# EAGLE design dockerkit (EAGLE 9.6.2)
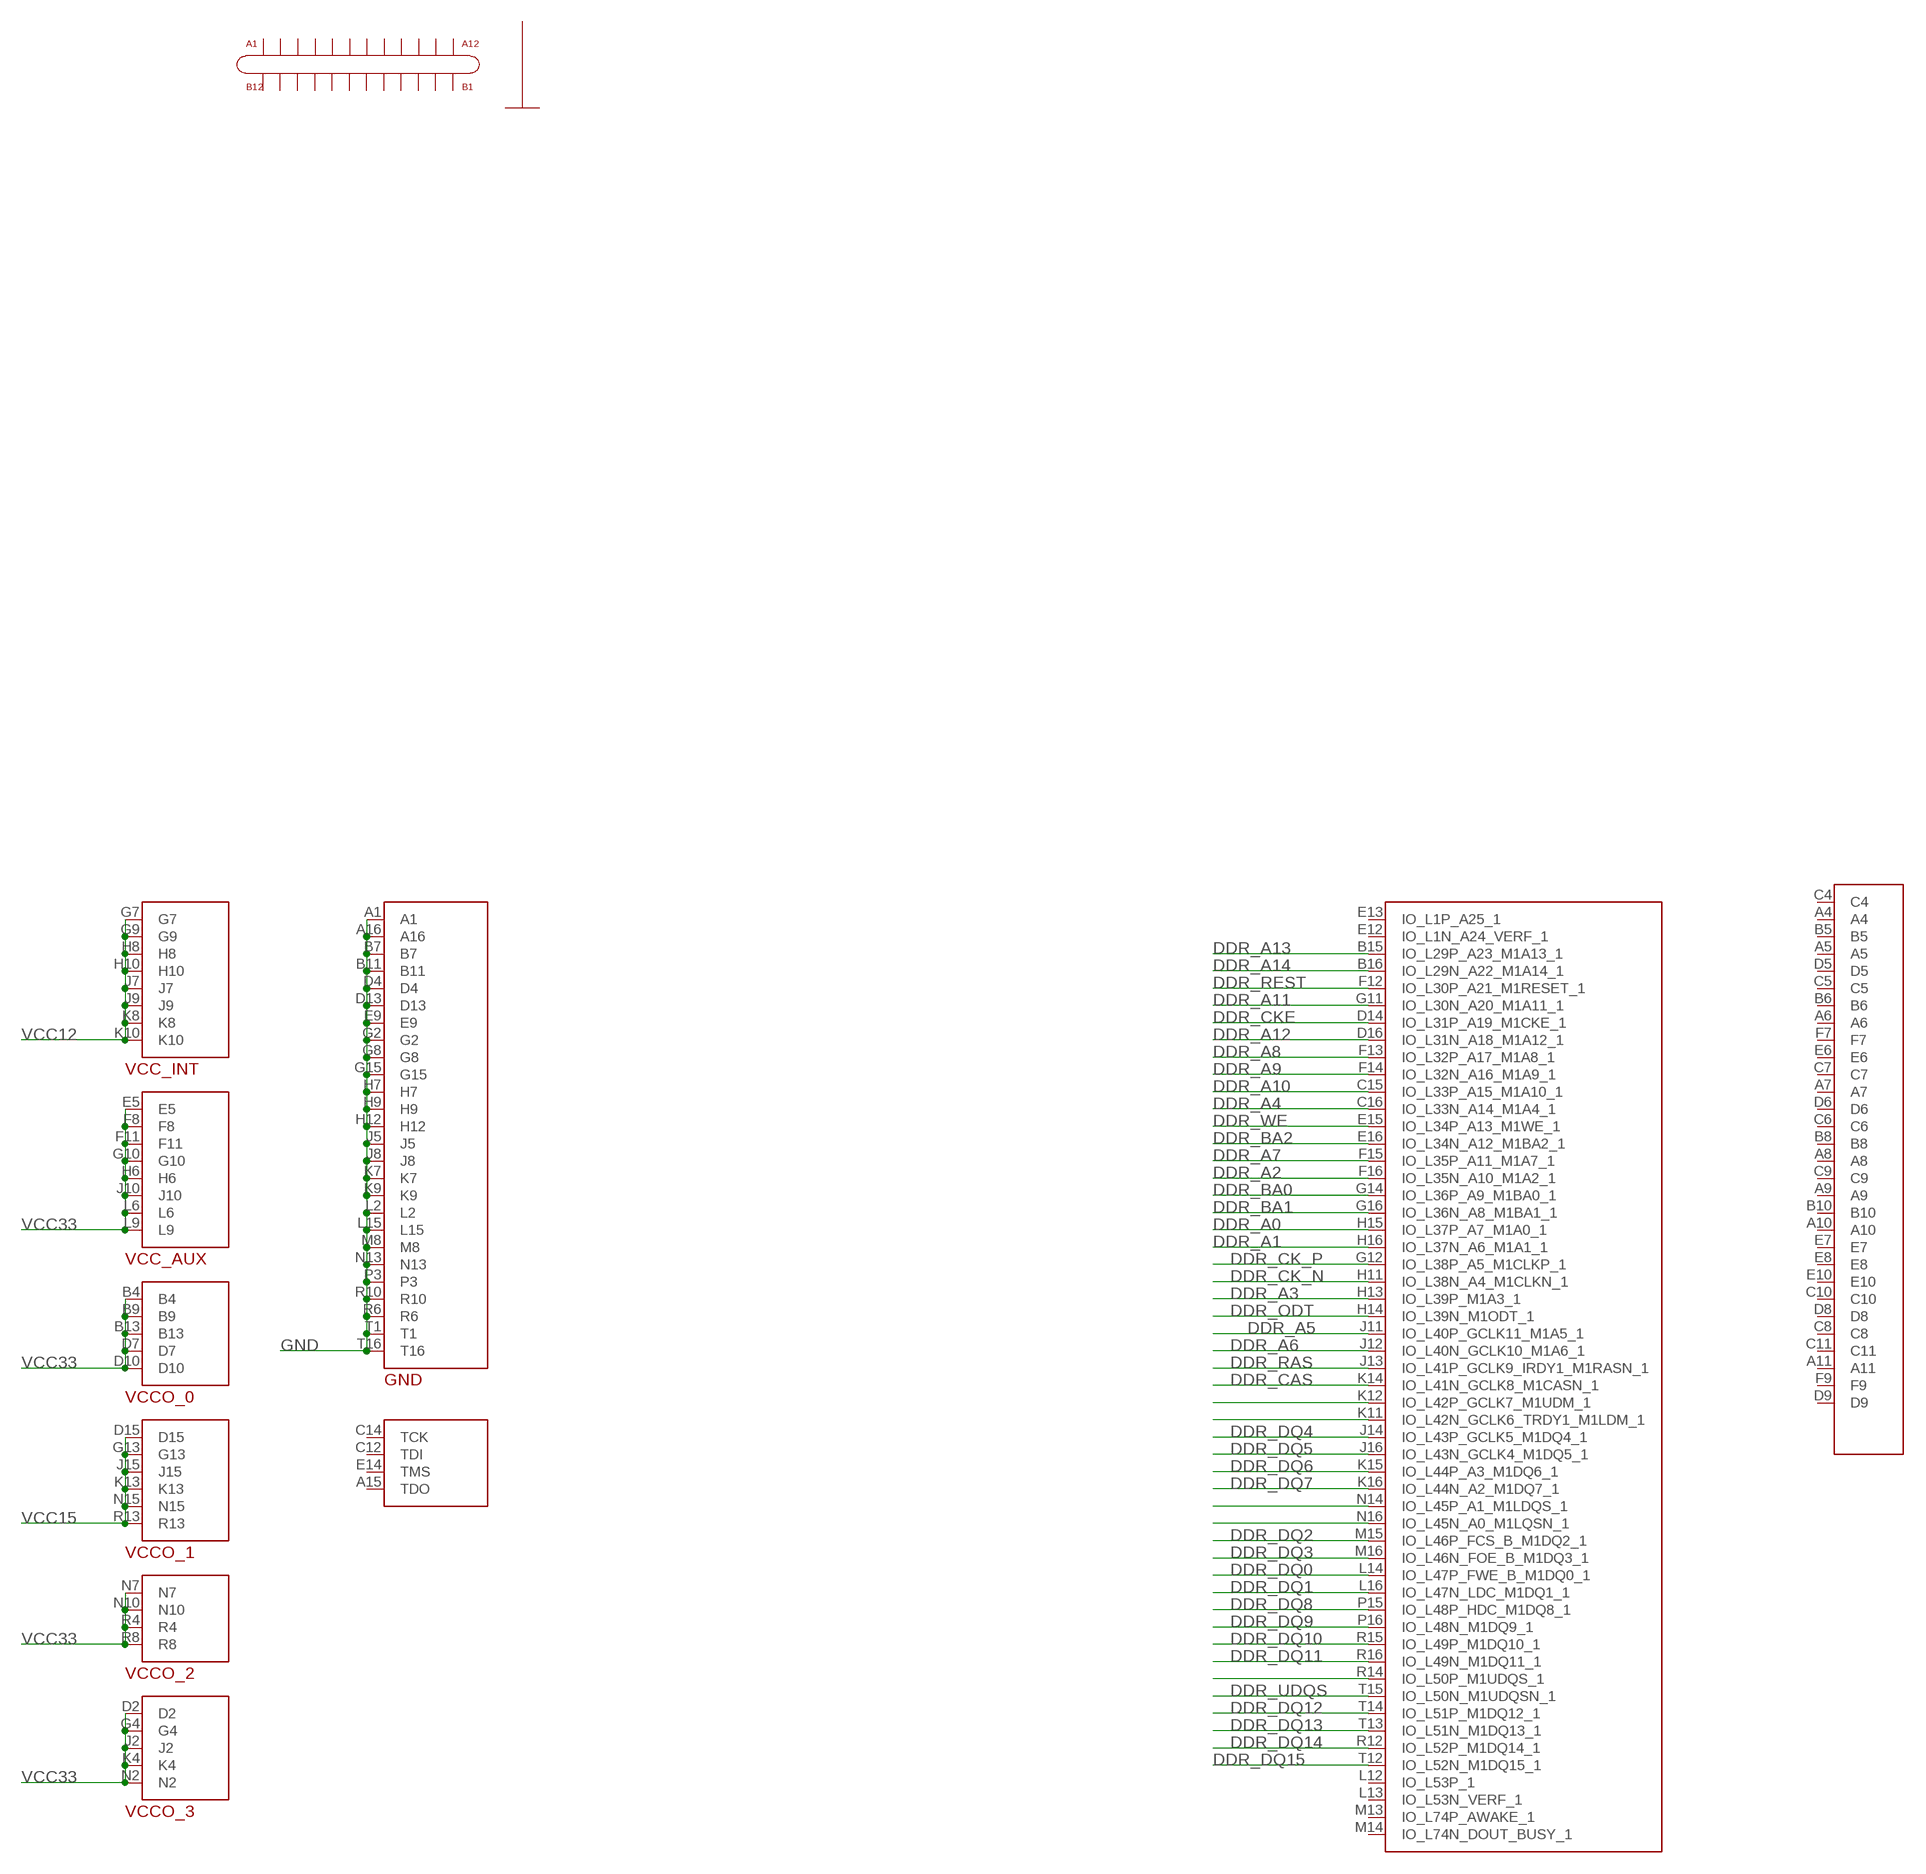
[diagram p0: schematic, sheet 1, part 1 of 3]
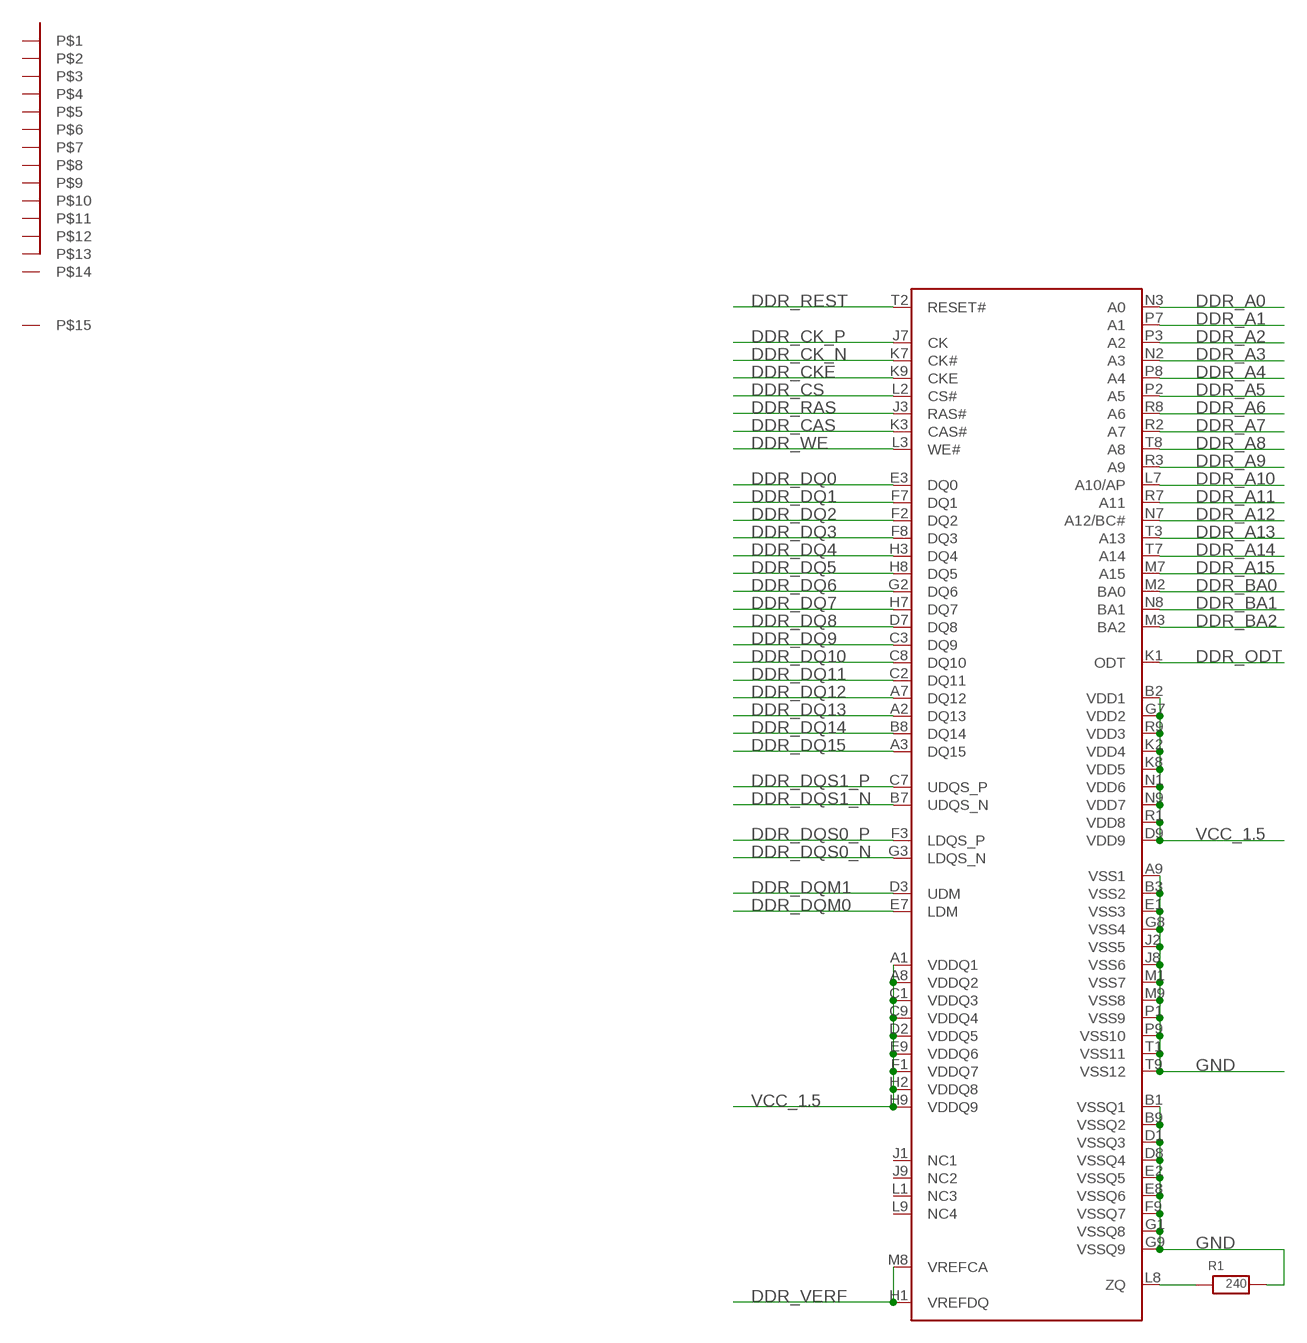
[diagram p1: schematic, sheet 1, part 2 of 3]
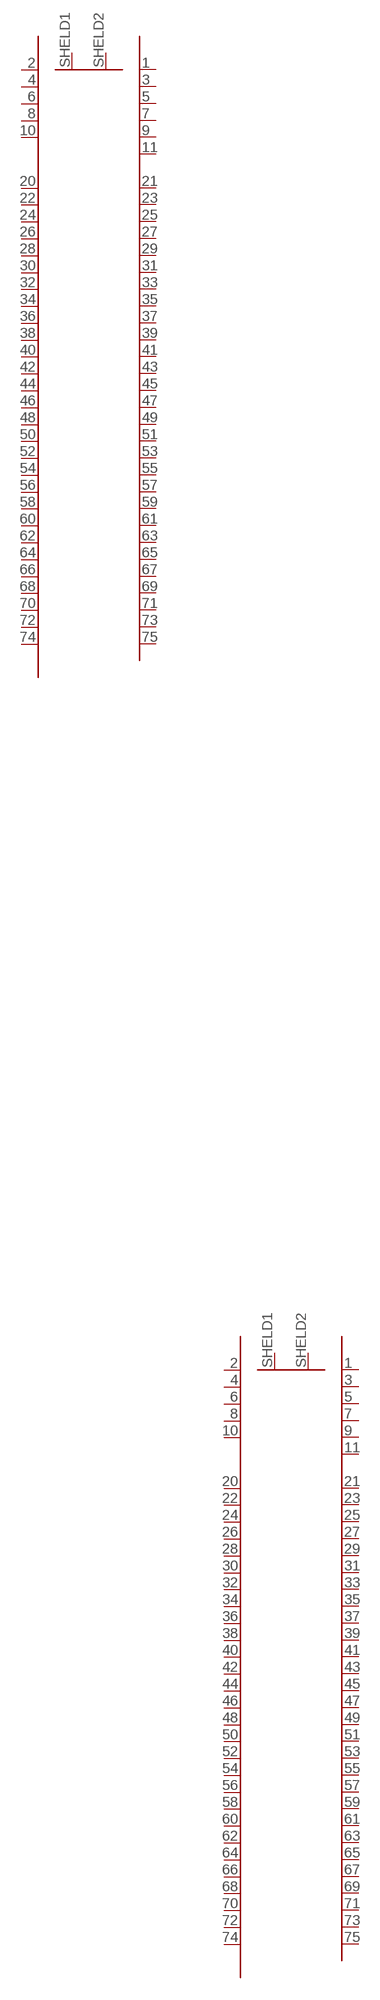
[diagram p2: schematic, sheet 1, part 3 of 3]

## Parts
R1  240  RESISTOR0402  [R0402]
U$1  B_KEY  [NGFF_SOCKET]
U$2  DDR3  [FBGA96]
U$3  B_KEY  [NGFF_SOCKET]
U$4  XC6SLX16  [FTG256]
U$5  USB3.1  [USB3.1_24PIN]
U$8  GIGABYTE_14P  [GIGABYTE_RJ45]

## Nets
DDR_A0 [DDR]: U$2.N3(A0) U$4.H15(IO_L37P_A7_M1A0_1)
DDR_A1 [DDR]: U$2.P7(A1) U$4.H16(IO_L37N_A6_M1A1_1)
DDR_A2 [DDR]: U$2.P3(A2) U$4.F16(IO_L35N_A10_M1A2_1)
DDR_A3 [DDR]: U$2.N2(A3) U$4.H13(IO_L39P_M1A3_1)
DDR_A4 [DDR]: U$2.P8(A4) U$4.C16(IO_L33N_A14_M1A4_1)
DDR_A5 [DDR]: U$2.P2(A5) U$4.J11(IO_L40P_GCLK11_M1A5_1)
DDR_A6 [DDR]: U$2.R8(A6) U$4.J12(IO_L40N_GCLK10_M1A6_1)
DDR_A7 [DDR]: U$2.R2(A7) U$4.F15(IO_L35P_A11_M1A7_1)
DDR_A8 [DDR]: U$2.T8(A8) U$4.F13(IO_L32P_A17_M1A8_1)
DDR_A9 [DDR]: U$2.R3(A9) U$4.F14(IO_L32N_A16_M1A9_1)
DDR_A10 [DDR]: U$2.L7(A10/AP) U$4.C15(IO_L33P_A15_M1A10_1)
DDR_A11 [DDR]: U$2.R7(A11) U$4.G11(IO_L30N_A20_M1A11_1)
DDR_A12 [DDR]: U$2.N7(A12/BC#) U$4.D16(IO_L31N_A18_M1A12_1)
DDR_A13 [DDR]: U$2.T3(A13) U$4.B15(IO_L29P_A23_M1A13_1)
DDR_A14 [DDR]: U$2.T7(A14) U$4.B16(IO_L29N_A22_M1A14_1)
DDR_A15 [DDR]: U$2.M7(A15)
DDR_BA0 [DDR]: U$2.M2(BA0) U$4.G14(IO_L36P_A9_M1BA0_1)
DDR_BA1 [DDR]: U$2.N8(BA1) U$4.G16(IO_L36N_A8_M1BA1_1)
DDR_BA2 [DDR]: U$2.M3(BA2) U$4.E16(IO_L34N_A12_M1BA2_1)
DDR_CAS [DDR]: U$2.K3(CAS#) U$4.K14(IO_L41N_GCLK8_M1CASN_1)
DDR_CK_N: U$2.K7(CK#) U$4.H11(IO_L38N_A4_M1CLKN_1)
DDR_CK_P: U$2.J7(CK) U$4.G12(IO_L38P_A5_M1CLKP_1)
DDR_CKE [DDR]: U$2.K9(CKE) U$4.D14(IO_L31P_A19_M1CKE_1)
DDR_CS [DDR]: U$2.L2(CS#)
DDR_DQ0 [DDR]: U$2.E3(DQ0) U$4.L14(IO_L47P_FWE_B_M1DQ0_1)
DDR_DQ1 [DDR]: U$2.F7(DQ1) U$4.L16(IO_L47N_LDC_M1DQ1_1)
DDR_DQ2 [DDR]: U$2.F2(DQ2) U$4.M15(IO_L46P_FCS_B_M1DQ2_1)
DDR_DQ3 [DDR]: U$2.F8(DQ3) U$4.M16(IO_L46N_FOE_B_M1DQ3_1)
DDR_DQ4 [DDR]: U$2.H3(DQ4) U$4.J14(IO_L43P_GCLK5_M1DQ4_1)
DDR_DQ5 [DDR]: U$2.H8(DQ5) U$4.J16(IO_L43N_GCLK4_M1DQ5_1)
DDR_DQ6 [DDR]: U$2.G2(DQ6) U$4.K15(IO_L44P_A3_M1DQ6_1)
DDR_DQ7 [DDR]: U$2.H7(DQ7) U$4.K16(IO_L44N_A2_M1DQ7_1)
DDR_DQ8 [DDR]: U$2.D7(DQ8) U$4.P15(IO_L48P_HDC_M1DQ8_1)
DDR_DQ9 [DDR]: U$2.C3(DQ9) U$4.P16(IO_L48N_M1DQ9_1)
DDR_DQ10 [DDR]: U$2.C8(DQ10) U$4.R15(IO_L49P_M1DQ10_1)
DDR_DQ11 [DDR]: U$2.C2(DQ11) U$4.R16(IO_L49N_M1DQ11_1)
DDR_DQ12 [DDR]: U$2.A7(DQ12) U$4.T14(IO_L51P_M1DQ12_1)
DDR_DQ13 [DDR]: U$2.A2(DQ13) U$4.T13(IO_L51N_M1DQ13_1)
DDR_DQ14 [DDR]: U$2.B8(DQ14) U$4.R12(IO_L52P_M1DQ14_1)
DDR_DQ15 [DDR]: U$2.A3(DQ15) U$4.T12(IO_L52N_M1DQ15_1)
DDR_DQM0 [DDR]: U$2.E7(LDM)
DDR_DQM1 [DDR]: U$2.D3(UDM)
DDR_DQS0_N: U$2.G3(LDQS_N)
DDR_DQS0_P: U$2.F3(LDQS_P)
DDR_DQS1_N: U$2.B7(UDQS_N)
DDR_DQS1_P: U$2.C7(UDQS_P)
DDR_ODT [DDR]: U$2.K1(ODT) U$4.H14(IO_L39N_M1ODT_1)
DDR_RAS [DDR]: U$2.J3(RAS#) U$4.J13(IO_L41P_GCLK9_IRDY1_M1RASN_1)
DDR_REST [DDR]: U$2.T2(RESET#) U$4.F12(IO_L30P_A21_M1RESET_1)
DDR_UDQS: U$4.T15(IO_L50N_M1UDQSN_1)
DDR_VERF [POWER]: U$2.H1(VREFDQ) U$2.M8(VREFCA)
DDR_WE [DDR]: U$2.L3(WE#) U$4.E15(IO_L34P_A13_M1WE_1)
GND [POWER]: R1.- U$2.A9(VSS1) U$2.B1(VSSQ1) U$2.B3(VSS2) U$2.B9(VSSQ2) U$2.D1(VSSQ3) U$2.D8(VSSQ4) U$2.E1(VSS3) U$2.E2(VSSQ5) U$2.E8(VSSQ6) U$2.F9(VSSQ7) U$2.G1(VSSQ8) U$2.G8(VSS4) U$2.G9(VSSQ9) U$2.J2(VSS5) U$2.J8(VSS6) U$2.M1(VSS7) U$2.M9(VSS8) U$2.P1(VSS9) U$2.P9(VSS10) U$2.T1(VSS11) U$2.T9(VSS12) U$4.A1 U$4.A16 U$4.B7 U$4.B11 U$4.D4 U$4.D13 U$4.E9 U$4.G2 U$4.G8 U$4.G15 U$4.H7 U$4.H9 U$4.H12 U$4.J5 U$4.J8 U$4.K7 U$4.K9 U$4.L2 U$4.L15 U$4.M8 U$4.N13 U$4.P3 U$4.R6 U$4.R10 U$4.T1 U$4.T16
N$3: R1.+ U$2.L8(ZQ)
N$12: U$4.K12(IO_L42P_GCLK7_M1UDM_1)
N$13: U$4.K11(IO_L42N_GCLK6_TRDY1_M1LDM_1)
N$15: U$4.B10
N$16: U$4.A10
N$17: U$4.E7
N$18: U$4.E8
N$22: U$4.N14(IO_L45P_A1_M1LDQS_1)
N$23: U$4.N16(IO_L45N_A0_M1LQSN_1)
N$32: U$4.R14(IO_L50P_M1UDQS_1)
VCC12 [POWER]: U$4.G7 U$4.G9 U$4.H8 U$4.H10 U$4.J7 U$4.J9 U$4.K8 U$4.K10
VCC15 [POWER]: U$4.D15 U$4.G13 U$4.J15 U$4.K13 U$4.N15 U$4.R13
VCC33 [POWER]: U$4.B4 U$4.B9 U$4.B13 U$4.D2 U$4.D7 U$4.D10 U$4.E5 U$4.F8 U$4.F11 U$4.G4 U$4.G10 U$4.H6 U$4.J2 U$4.J10 U$4.K4 U$4.L6 U$4.L9 U$4.N2 U$4.N7 U$4.N10 U$4.R4 U$4.R8
VCC_1.5 [POWER]: U$2.A1(VDDQ1) U$2.A8(VDDQ2) U$2.B2(VDD1) U$2.C1(VDDQ3) U$2.C9(VDDQ4) U$2.D2(VDDQ5) U$2.D9(VDD9) U$2.E9(VDDQ6) U$2.F1(VDDQ7) U$2.G7(VDD2) U$2.H2(VDDQ8) U$2.H9(VDDQ9) U$2.K2(VDD4) U$2.K8(VDD5) U$2.N1(VDD6) U$2.N9(VDD7) U$2.R1(VDD8) U$2.R9(VDD3)
Unconnected: U$1.1(PIN1) U$1.2(PIN2) U$1.3(PIN3) U$1.4(PIN4) U$1.5(PIN5) U$1.6(PIN6) U$1.7(PIN7) U$1.8(PIN8) U$1.9(PIN9) U$1.10(PIN10) U$1.11(PIN11) U$1.20(PIN20) U$1.21(PIN21) U$1.22(PIN22) U$1.23(PIN23) U$1.24(PIN24) U$1.25(PIN25) U$1.26(PIN26) U$1.27(PIN27) U$1.28(PIN28) U$1.29(PIN29) U$1.30(PIN30) U$1.31(PIN31) U$1.32(PIN32) U$1.33(PIN33) U$1.34(PIN34) U$1.35(PIN35) U$1.36(PIN36) U$1.37(PIN37) U$1.38(PIN38) U$1.39(PIN39) U$1.40(PIN40) U$1.41(PIN41) U$1.42(PIN42) U$1.43(PIN43) U$1.44(PIN44) U$1.45(PIN45) U$1.46(PIN46) U$1.47(PIN47) U$1.48(PIN48) U$1.49(PIN49) U$1.50(PIN50) U$1.51(PIN51) U$1.52(PIN52) U$1.53(PIN53) U$1.54(PIN54) U$1.55(PIN55) U$1.56(PIN56) U$1.57(PIN57) U$1.58(PIN58) U$1.59(PIN59) U$1.60(PIN60) U$1.61(PIN61) U$1.62(PIN62) U$1.63(PIN63) U$1.64(PIN64) U$1.65(PIN65) U$1.66(PIN66) U$1.67(PIN67) U$1.68(PIN68) U$1.69(PIN69) U$1.70(PIN70) U$1.71(PIN71) U$1.72(PIN72) U$1.73(PIN73) U$1.74(PIN74) U$1.75(PIN75) U$1.SHELD1 U$1.SHELD2(SHEDL2) U$2.J1(NC1) U$2.J9(NC2) U$2.L1(NC3) U$2.L9(NC4) U$3.1(PIN1) U$3.2(PIN2) U$3.3(PIN3) U$3.4(PIN4) U$3.5(PIN5) U$3.6(PIN6) U$3.7(PIN7) U$3.8(PIN8) U$3.9(PIN9) U$3.10(PIN10) U$3.11(PIN11) U$3.20(PIN20) U$3.21(PIN21) U$3.22(PIN22) U$3.23(PIN23) U$3.24(PIN24) U$3.25(PIN25) U$3.26(PIN26) U$3.27(PIN27) U$3.28(PIN28) U$3.29(PIN29) U$3.30(PIN30) U$3.31(PIN31) U$3.32(PIN32) U$3.33(PIN33) U$3.34(PIN34) U$3.35(PIN35) U$3.36(PIN36) U$3.37(PIN37) U$3.38(PIN38) U$3.39(PIN39) U$3.40(PIN40) U$3.41(PIN41) U$3.42(PIN42) U$3.43(PIN43) U$3.44(PIN44) U$3.45(PIN45) U$3.46(PIN46) U$3.47(PIN47) U$3.48(PIN48) U$3.49(PIN49) U$3.50(PIN50) U$3.51(PIN51) U$3.52(PIN52) U$3.53(PIN53) U$3.54(PIN54) U$3.55(PIN55) U$3.56(PIN56) U$3.57(PIN57) U$3.58(PIN58) U$3.59(PIN59) U$3.60(PIN60) U$3.61(PIN61) U$3.62(PIN62) U$3.63(PIN63) U$3.64(PIN64) U$3.65(PIN65) U$3.66(PIN66) U$3.67(PIN67) U$3.68(PIN68) U$3.69(PIN69) U$3.70(PIN70) U$3.71(PIN71) U$3.72(PIN72) U$3.73(PIN73) U$3.74(PIN74) U$3.75(PIN75) U$3.SHELD1 U$3.SHELD2(SHEDL2) U$4.A4 U$4.A5 U$4.A6 U$4.A7 U$4.A8 U$4.A9 U$4.A11 U$4.A15(TDO) U$4.B5 U$4.B6 U$4.B8 U$4.C4 U$4.C5 U$4.C6 U$4.C7 U$4.C8 U$4.C9 U$4.C10 U$4.C11 U$4.C12(TDI) U$4.C14(TCK) U$4.D5 U$4.D6 U$4.D8 U$4.D9 U$4.E6 U$4.E10 U$4.E12(IO_L1N_A24_VERF_1) U$4.E13(IO_L1P_A25_1) U$4.E14(TMS) U$4.F7 U$4.F9 U$4.L12(IO_L53P_1) U$4.L13(IO_L53N_VERF_1) U$4.M13(IO_L74P_AWAKE_1) U$4.M14(IO_L74N_DOUT_BUSY_1) U$5.A1 U$5.A2 U$5.A3 U$5.A4 U$5.A5 U$5.A6 U$5.A7 U$5.A8 U$5.A9 U$5.A10 U$5.A11 U$5.A12 U$5.B1(B12) U$5.B2(B11) U$5.B3(B10) U$5.B4(B9) U$5.B5(B8) U$5.B6(B7) U$5.B7(B6) U$5.B8(B5) U$5.B9(B4) U$5.B10(B3) U$5.B11(B2) U$5.B12(B1) U$5.SHELD1 U$5.SHELD2 U$5.SHELD3 U$5.SHELD4 U$8.1 U$8.2 U$8.3 U$8.4 U$8.5 U$8.6 U$8.7 U$8.8 U$8.9 U$8.10 U$8.11 U$8.12 U$8.13 U$8.14 U$8.SHELL1 U$8.SHELL2

## Library data of the parts
R1 = Resistors&Capacitors:RESISTOR
U$1 U$3 = NGFF_Connetor:B_KEY
U$2 = IC_Memory:DDR3
U$4 = IC_FPGA:XC6SLX16
U$5 = Connector:USB3.1
U$8 = Connector:GIGABYTE_14P

## Net classes
0 singl: width 0.102 mm, drill 0.25 mm, clearance 0.127 mm
1 POWER: width 0.305 mm, drill 0.25 mm, clearance 0.127 mm
2 DDR: width 0.102 mm, clearance 0.229 mm

## Board
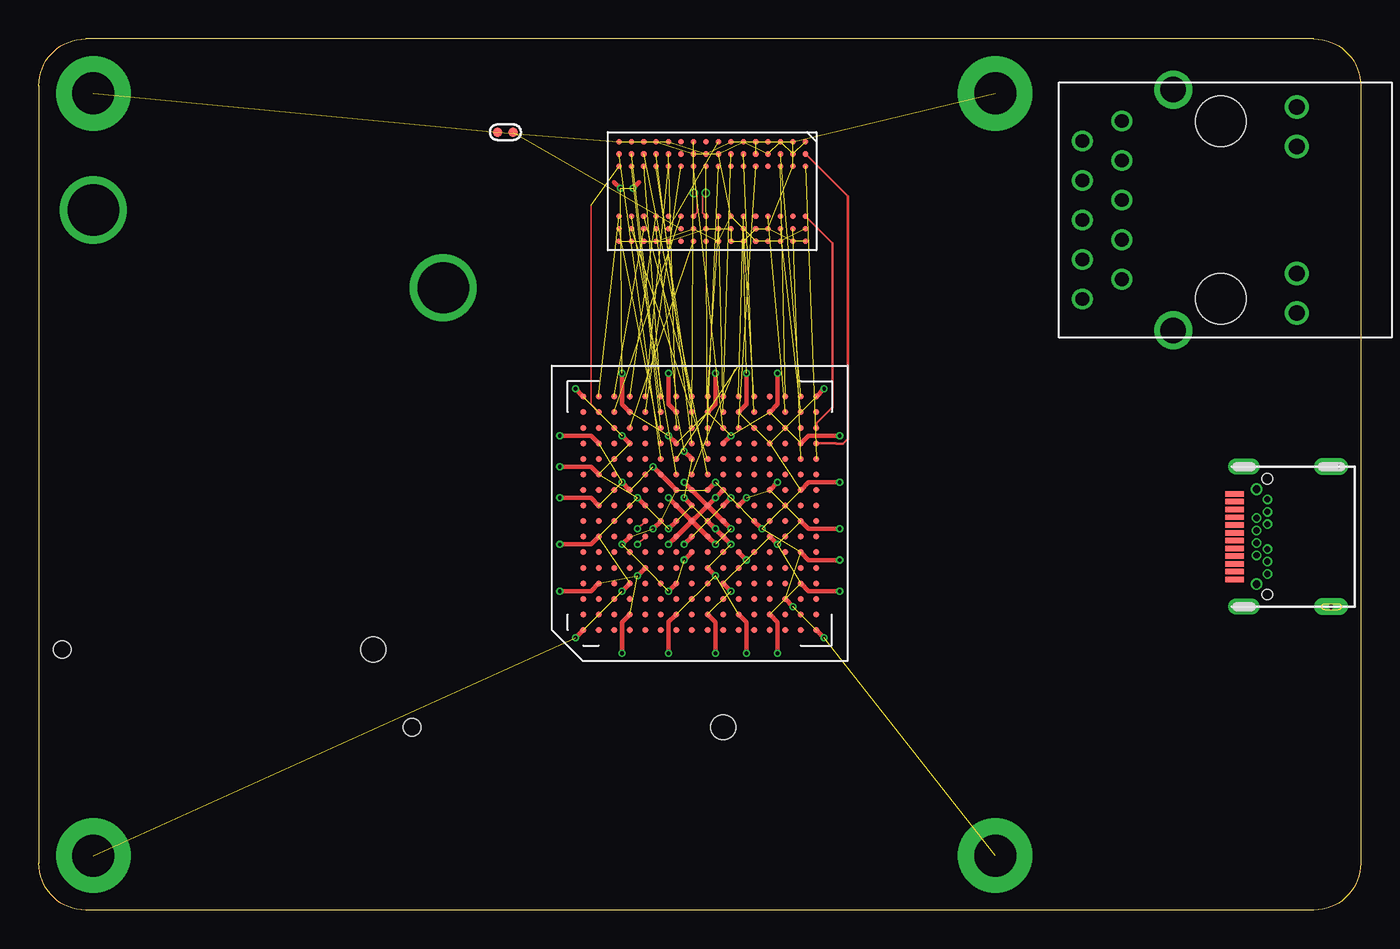
[diagram p3: board, top side]
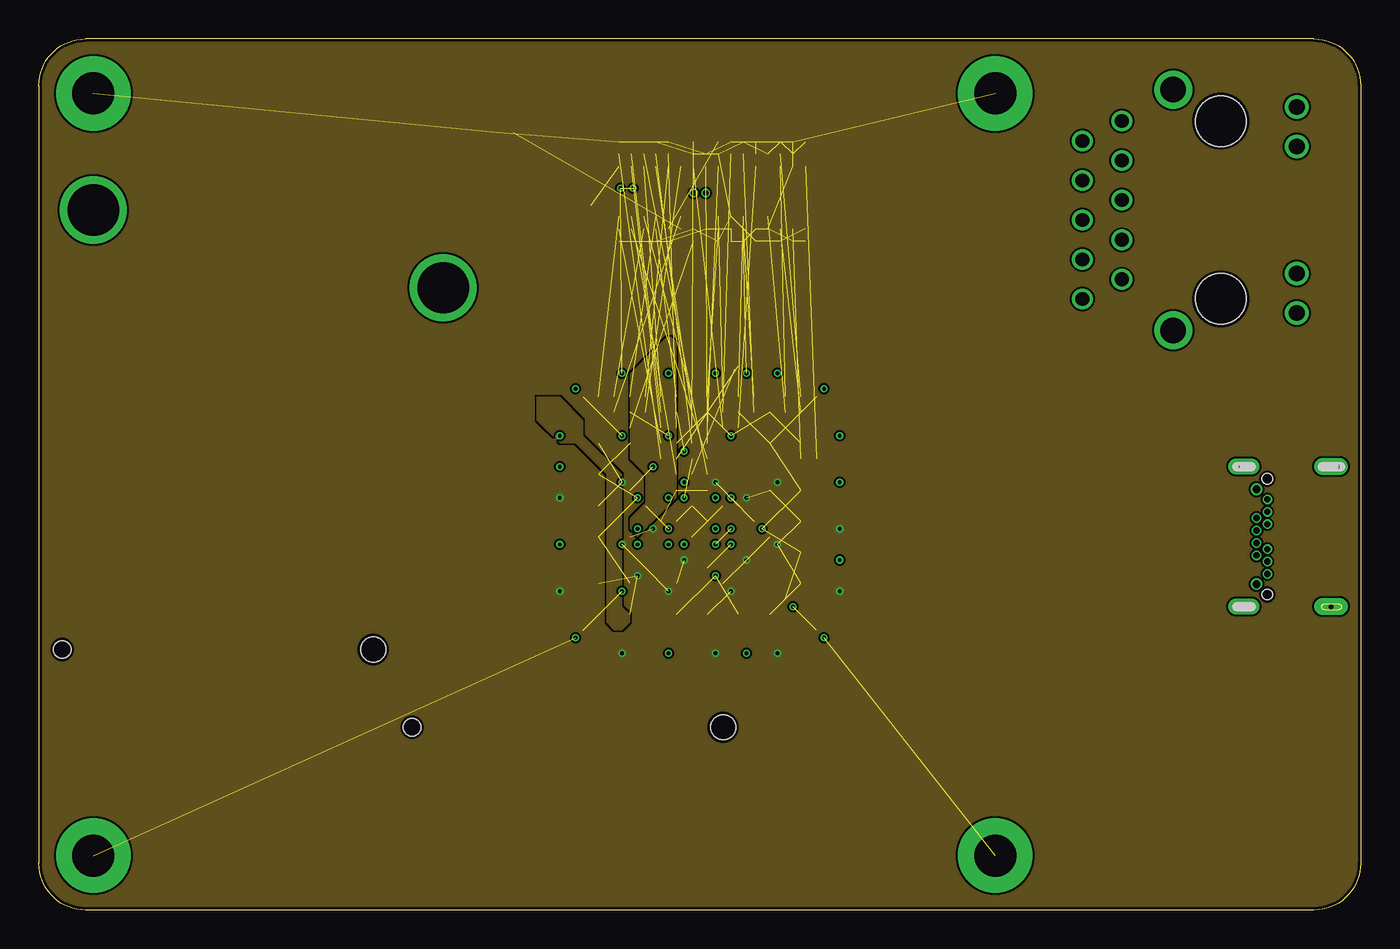
[diagram p4: board, inner layer Route2]
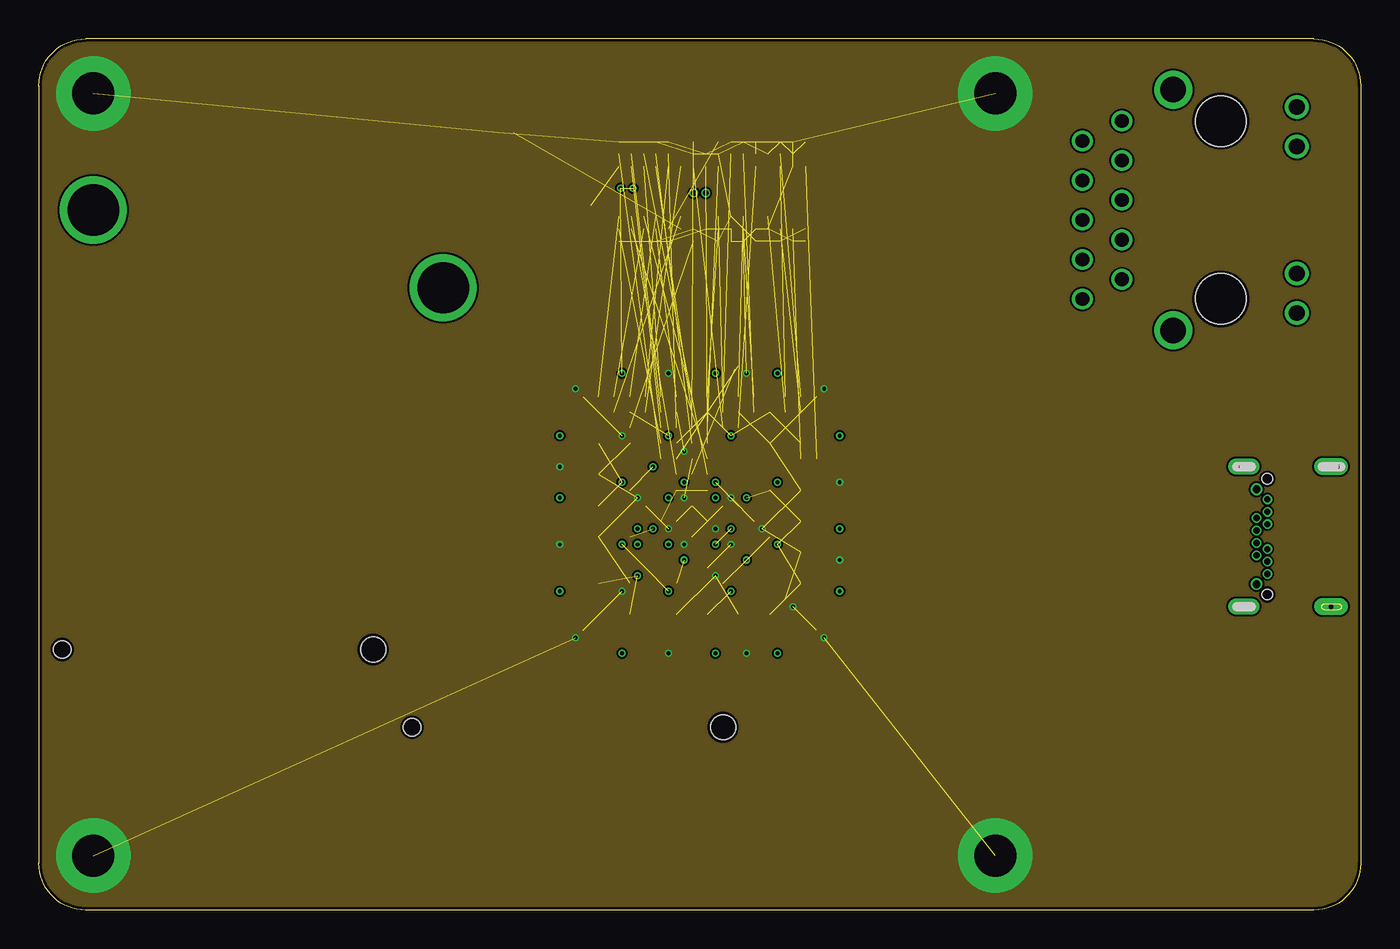
[diagram p5: board, inner layer Route15]
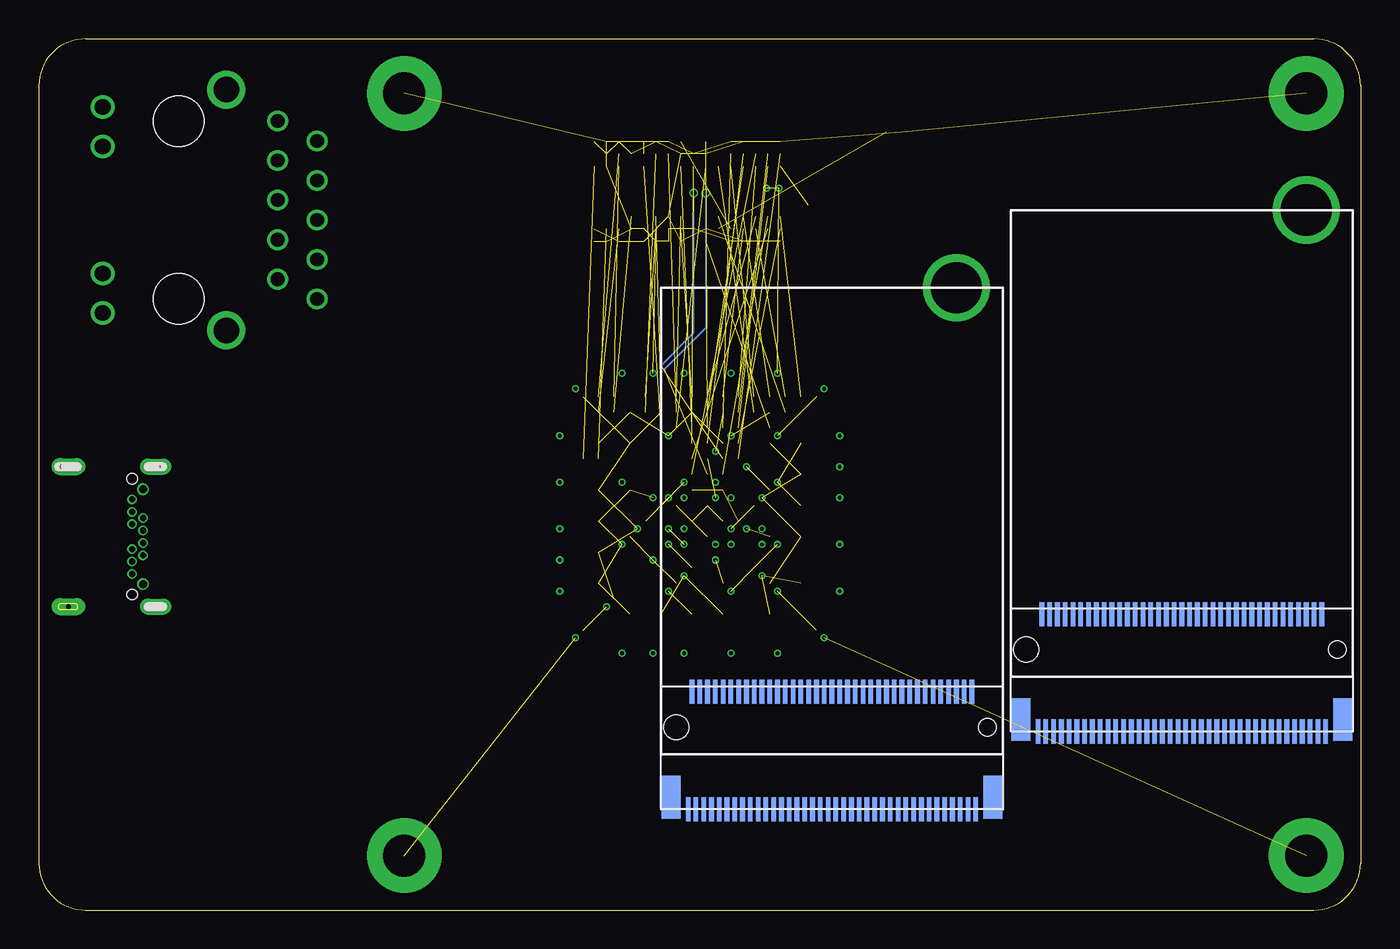
[diagram p6: board, bottom side, seen from below]

Size 85 x 56 mm. Coordinates in mm from the lower left corner, seen from the top.
Outline: 82,56 3,56 arc90 0,53 0,3 arc90 3,0 82,0 arc90 85,3 85,53 arc90 82,56
Copper layers (1+2*15+16): Top 0.035mm / dielectric 0.2mm / Route2 0.0175mm / dielectric 1.065mm / Route15 0.0175mm / dielectric 0.2mm / Bottom 0.035mm
Design rules "default *": minimum track width 3.5mil, minimum drill 0.25mm, track to track 5mil, track to pad 5mil, pad to pad 5mil, via to via 5mil, smd to smd 5mil, copper to edge 0.2mm, drill to drill 6mil, minimum pad ring 4mil, minimum via ring 4mil, stop-mask expansion 0.5mil, vias tented up to drill 0.45mm, thermal gap 6mil

### Footprints (pad centres in the part's own frame; a part is rotated, then mirrored left to right if it is on the bottom)
R0402 = smd 0.6 x 0.6: + -0.5,0; - 0.5,0
NGFF_SOCKET = smd 0.3 x 1.55: 1 -9.25,8.325; 2 -9,0.775; 3 -8.75,8.325; 4 -8.5,0.775; 5 -8.25,8.325; 6 -8,0.775; 7 -7.75,8.325; 8 -7.5,0.775; 9 -7.25,8.325; 10 -7,0.775; 11 -6.75,8.325; 12 -6.5,0.775; 13 -6.25,8.325; 14 -6,0.775; 15 -5.75,8.325; 16 -5.5,0.775; 17 -5.25,8.325; 18 -5,0.775; 19 -4.75,8.325; 20 -4.5,0.775; 21 -4.25,8.325; 22 -4,0.775; 23 -3.75,8.325; 24 -3.5,0.775; 25 -3.25,8.325; 26 -3,0.775; 27 -2.75,8.325; 28 -2.5,0.775; 29 -2.25,8.325; 30 -2,0.775; 31 -1.75,8.325; 32 -1.5,0.775; 33 -1.25,8.325; 34 -1,0.775; 35 -0.75,8.325; 36 -0.5,0.775; 37 -0.25,8.325; 38 0,0.775; 39 0.25,8.325; 40 0.5,0.775; 41 0.75,8.325; 42 1,0.775; 43 1.25,8.325; 44 1.5,0.775; 45 1.75,8.325; 46 2,0.775; 47 2.25,8.325; 48 2.5,0.775; 49 2.75,8.325; 50 3,0.775; 51 3.25,8.325; 52 3.5,0.775; 53 3.75,8.325; 54 4,0.775; 55 4.25,8.325; 56 4.5,0.775; 57 4.75,8.325; 58 5,0.775; 59 5.25,8.325; 60 5.5,0.775; 61 5.75,8.325; 62 6,0.775; 63 6.25,8.325; 64 6.5,0.775; 65 6.75,8.325; 66 7,0.775; 67 7.25,8.325; 68 7.5,0.775; 69 7.75,8.325; 70 8,0.775; 71 8.25,8.325; 72 8.5,0.775; 73 8.75,8.325; 74 9,0.775; 75 9.25,8.325 | smd 1.2 x 2.75: SHELD1 -10.35,7.55; SHELD2 10.35,7.55 | hole 1.1: -10,3.05 | hole 1.6: 10,3.05
FBGA96 = smd 0.35 x 0.35: A1 0.6,-0.7; A2 1.4,-0.7; A3 2.2,-0.7; A7 5.4,-0.7; A8 6.2,-0.7; A9 7,-0.7; B1 0.6,-1.5; B2 1.4,-1.5; B3 2.2,-1.5; B7 5.4,-1.5; B8 6.2,-1.5; B9 7,-1.5; C1 0.6,-2.3; C2 1.4,-2.3; C3 2.2,-2.3; C7 5.4,-2.3; C8 6.2,-2.3; C9 7,-2.3; D1 0.6,-3.1; D2 1.4,-3.1; D3 2.2,-3.1; D7 5.4,-3.1; D8 6.2,-3.1; D9 7,-3.1; E1 0.6,-3.9; E2 1.4,-3.9; E3 2.2,-3.9; E7 5.4,-3.9; E8 6.2,-3.9; E9 7,-3.9; F1 0.6,-4.7; F2 1.4,-4.7; F3 2.2,-4.7; F7 5.4,-4.7; F8 6.2,-4.7; F9 7,-4.7; G1 0.6,-5.5; G2 1.4,-5.5; G3 2.2,-5.5; G7 5.4,-5.5; G8 6.2,-5.5; G9 7,-5.5; H1 0.6,-6.3; H2 1.4,-6.3; H3 2.2,-6.3; H7 5.4,-6.3; H8 6.2,-6.3; H9 7,-6.3; J1 0.6,-7.1; J2 1.4,-7.1; J3 2.2,-7.1; J7 5.4,-7.1; J8 6.2,-7.1; J9 7,-7.1; K1 0.6,-7.9; K2 1.4,-7.9; K3 2.2,-7.9; K7 5.4,-7.9; K8 6.2,-7.9; K9 7,-7.9; L1 0.6,-8.7; L2 1.4,-8.7; L3 2.2,-8.7; L7 5.4,-8.7; L8 6.2,-8.7; L9 7,-8.7; M1 0.6,-9.5; M2 1.4,-9.5; M3 2.2,-9.5; M7 5.4,-9.5; M8 6.2,-9.5; M9 7,-9.5; N1 0.6,-10.3; N2 1.4,-10.3; N3 2.2,-10.3; N7 5.4,-10.3; N8 6.2,-10.3; N9 7,-10.3; P1 0.6,-11.1; P2 1.4,-11.1; P3 2.2,-11.1; P7 5.4,-11.1; P8 6.2,-11.1; P9 7,-11.1; R1 0.6,-11.9; R2 1.4,-11.9; R3 2.2,-11.9; R7 5.4,-11.9; R8 6.2,-11.9; R9 7,-11.9; T1 0.6,-12.7; T2 1.4,-12.7; T3 2.2,-12.7; T7 5.4,-12.7; T8 6.2,-12.7; T9 7,-12.7
FTG256 = smd 0.4 x 0.4: A1 1,-1; A2 2,-1; A3 3,-1; A4 4,-1; A5 5,-1; A6 6,-1; A7 7,-1; A8 8,-1; A9 9,-1; A10 10,-1; A11 11,-1; A12 12,-1; A13 13,-1; A14 14,-1; A15 15,-1; A16 16,-1; B1 1,-2; B2 2,-2; B3 3,-2; B4 4,-2; B5 5,-2; B6 6,-2; B7 7,-2; B8 8,-2; B9 9,-2; B10 10,-2; B11 11,-2; B12 12,-2; B13 13,-2; B14 14,-2; B15 15,-2; B16 16,-2; C1 1,-3; C2 2,-3; C3 3,-3; C4 4,-3; C5 5,-3; C6 6,-3; C7 7,-3; C8 8,-3; C9 9,-3; C10 10,-3; C11 11,-3; C12 12,-3; C13 13,-3; C14 14,-3; C15 15,-3; C16 16,-3; D1 1,-4; D2 2,-4; D3 3,-4; D4 4,-4; D5 5,-4; D6 6,-4; D7 7,-4; D8 8,-4; D9 9,-4; D10 10,-4; D11 11,-4; D12 12,-4; D13 13,-4; D14 14,-4; D15 15,-4; D16 16,-4; E1 1,-5; E2 2,-5; E3 3,-5; E4 4,-5; E5 5,-5; E6 6,-5; E7 7,-5; E8 8,-5; E9 9,-5; E10 10,-5; E11 11,-5; E12 12,-5; E13 13,-5; E14 14,-5; E15 15,-5; E16 16,-5; F1 1,-6; F2 2,-6; F3 3,-6; F4 4,-6; F5 5,-6; F6 6,-6; F7 7,-6; F8 8,-6; F9 9,-6; F10 10,-6; F11 11,-6; F12 12,-6; F13 13,-6; F14 14,-6; F15 15,-6; F16 16,-6; G1 1,-7; G2 2,-7; G3 3,-7; G4 4,-7; G5 5,-7; G6 6,-7; G7 7,-7; G8 8,-7; G9 9,-7; G10 10,-7; G11 11,-7; G12 12,-7; G13 13,-7; G14 14,-7; G15 15,-7; G16 16,-7; H1 1,-8; H2 2,-8; H3 3,-8; H4 4,-8; H5 5,-8; H6 6,-8; H7 7,-8; H8 8,-8; H9 9,-8; H10 10,-8; H11 11,-8; H12 12,-8; H13 13,-8; H14 14,-8; H15 15,-8; H16 16,-8; J1 1,-9; J2 2,-9; J3 3,-9; J4 4,-9; J5 5,-9; J6 6,-9; J7 7,-9; J8 8,-9; J9 9,-9; J10 10,-9; J11 11,-9; J12 12,-9; J13 13,-9; J14 14,-9; J15 15,-9; J16 16,-9; K1 1,-10; K2 2,-10; K3 3,-10; K4 4,-10; K5 5,-10; K6 6,-10; K7 7,-10; K8 8,-10; K9 9,-10; K10 10,-10; K11 11,-10; K12 12,-10; K13 13,-10; K14 14,-10; K15 15,-10; K16 16,-10; L1 1,-11; L2 2,-11; L3 3,-11; L4 4,-11; L5 5,-11; L6 6,-11; L7 7,-11; L8 8,-11; L9 9,-11; L10 10,-11; L11 11,-11; L12 12,-11; L13 13,-11; L14 14,-11; L15 15,-11; L16 16,-11; M1 1,-12; M2 2,-12; M3 3,-12; M4 4,-12; M5 5,-12; M6 6,-12; M7 7,-12; M8 8,-12; M9 9,-12; M10 10,-12; M11 11,-12; M12 12,-12; M13 13,-12; M14 14,-12; M15 15,-12; M16 16,-12; N1 1,-13; N2 2,-13; N3 3,-13; N4 4,-13; N5 5,-13; N6 6,-13; N7 7,-13; N8 8,-13; N9 9,-13; N10 10,-13; N11 11,-13; N12 12,-13; N13 13,-13; N14 14,-13; N15 15,-13; N16 16,-13; P1 1,-14; P2 2,-14; P3 3,-14; P4 4,-14; P5 5,-14; P6 6,-14; P7 7,-14; P8 8,-14; P9 9,-14; P10 10,-14; P11 11,-14; P12 12,-14; P13 13,-14; P14 14,-14; P15 15,-14; P16 16,-14; R1 1,-15; R2 2,-15; R3 3,-15; R4 4,-15; R5 5,-15; R6 6,-15; R7 7,-15; R8 8,-15; R9 9,-15; R10 10,-15; R11 11,-15; R12 12,-15; R13 13,-15; R14 14,-15; R15 15,-15; R16 16,-15; T1 1,-16; T2 2,-16; T3 3,-16; T4 4,-16; T5 5,-16; T6 6,-16; T7 7,-16; T8 8,-16; T9 9,-16; T10 10,-16; T11 11,-16; T12 12,-16; T13 13,-16; T14 14,-16; T15 15,-16; T16 16,-16
USB3.1_24PIN = smd 0.35 x 1.2: A1 -2.75,2.1; A2 -2.25,2.1; A3 -1.75,2.1; A4 -1.25,2.1; A5 -0.75,2.1; A6 -0.25,2.1; A7 0.25,2.1; A8 0.75,2.1; A9 1.25,2.1; A10 1.75,2.1; A11 2.25,2.1; A12 2.75,2.1 | drill 0.5 pad 0.711: B1 3.05,0.7; B12 -3.05,0.7 | drill 0.4 pad 0.61: B2 2.4,0; B3 1.6,0; B4 1.2,0.7; B5 0.8,0; B6 0.4,0.7; B7 -0.4,0.7; B8 -0.8,0; B9 -1.2,0.7; B10 -1.6,0; B11 -2.4,0 | drill 0.3 pad 1.016 long: SHELD1 -4.5,1.51; SHELD2 4.5,1.51 | drill 0.3 pad 1.1 long: SHELD3 -4.5,-4.1; SHELD4 4.5,-4.1 | hole 0.5: -4.5,1.05; -4.5,1.9; -4.5,1.7; -4.5,1.3; -4.5,1.8; -4.5,1.2; -4.5,1.6; -4.5,1.4; -4.5,1.1; -4.5,1.96; 4.5,1.05; 4.5,1.9; 4.5,1.7; 4.5,1.3; 4.5,1.8; 4.5,1.2; 4.5,1.6; 4.5,1.4; 4.5,1.1; 4.5,1.96; 4.5,-4.56; 4.5,-3.71; 4.5,-3.91; 4.5,-4.31; 4.5,-3.81; 4.5,-4.41; 4.5,-4.01; 4.5,-4.21; 4.5,-4.51; 4.5,-3.65; 4.5,-4.11; 4.5,-4.65; 4.5,-4.71; 4.5,-4.72; 4.5,-3.56; 4.5,-3.55; -4.5,1.5; 4.5,1.48 | hole 0.65: 3.725,0; -3.725,0
GIGABYTE_RJ45 = drill 0.89: 1 5.72,-8.89; 2 4.46,-6.35; 3 3.18,-8.89; 4 1.92,-6.35; 5 0.64,-8.89; 6 -0.64,-6.35; 7 -1.9,-8.89; 8 -3.18,-6.35; 9 -4.44,-8.89; 10 -5.72,-6.35 | drill 1.02: 11 6.625,4.9; 12 4.085,4.9; 13 -4.085,4.9; 14 -6.625,4.9 | drill 1.63: SHELL1 -7.745,-3.05; SHELL2 7.745,-3.05 | hole 3.25: -5.715,0; 5.715,0

### Placement (x,y rotation side)
R1  30,50 180 top
U$1  34,14.8 180 bottom
U$2  50,50 270 top
U$3  11.5,19.8 180 bottom
U$4  34,17 90 top
U$5  79,24 90 top
U$8  76,45 270 top

### Tracks (layer width: path | path; a pad name or v marks a point on that pad's centre or on a via)
DDR_A0  (1 unrouted)
DDR_A1  (1 unrouted)
DDR_A2  (1 unrouted)
DDR_A3  (1 unrouted)
DDR_A4  (1 unrouted)
DDR_A5  (1 unrouted)
DDR_A6  (1 unrouted)
DDR_A7  (1 unrouted)
DDR_A8  (1 unrouted)
DDR_A9  (1 unrouted)
DDR_A10  (1 unrouted)
DDR_A11  (1 unrouted)
DDR_A12  (1 unrouted)
DDR_A13  (1 unrouted)
  Top 0.102: U$4.B15 35.5,32.5 35.5,45.3
DDR_A14  (1 unrouted)
DDR_BA0  (1 unrouted)
DDR_BA1  (1 unrouted)
DDR_BA2  (1 unrouted)
DDR_CAS  (1 unrouted)
DDR_CK_N  (via drill 0.35)  (1 unrouted)
  Top 0.102: U$2.K7 42.34,44.84 42.34,46.1 v42.11,46.1
  Bottom 0.102: v42.11,46.1 42.11,37.42 44.77,34.77
DDR_CK_P  (via drill 0.35)  (1 unrouted)
  Top 0.102: U$2.J7 42.66,44.84 42.66,46.1 v42.89,46.1
  Bottom 0.102: v42.89,46.1 42.89,37.11 45,35
DDR_CKE  (1 unrouted)
DDR_DQ0  (1 unrouted)
DDR_DQ1  (1 unrouted)
DDR_DQ2  (1 unrouted)
DDR_DQ3  (1 unrouted)
DDR_DQ4  (1 unrouted)
DDR_DQ5  (1 unrouted)
DDR_DQ6  (1 unrouted)
DDR_DQ7  (1 unrouted)
DDR_DQ8  (1 unrouted)
DDR_DQ9  (1 unrouted)
DDR_DQ10  (1 unrouted)
DDR_DQ11  (1 unrouted)
DDR_DQ12
  Top 0.152: U$4.T14 50,31.29 51.03,32.32 51.03,42.87 U$2.A7
DDR_DQ13
  Top 0.152: U$4.T13 51.25,30 51.28,29.97 51.72,29.97 52.03,30.28 52.03,45.87 U$2.A2
DDR_DQ14  (1 unrouted)
DDR_DQ15  (1 unrouted)
DDR_ODT  (1 unrouted)
DDR_RAS  (1 unrouted)
DDR_REST  (1 unrouted)
DDR_VERF  (1 unrouted)
DDR_WE  (1 unrouted)
GND  (via drill 0.25, 2.7 pad 4.8)  (50 unrouted)
  Top 0.305: U$4.K9 v44.5,26.5 | U$4.D4 v37.5,20.5 | U$4.A1 v34.5,17.5 | U$4.T16 v50.5,33.5 | U$4.P3 v48.5,19.5 | v50.5,17.5 U$4.T1 | U$4.D13 v37.5,30.5 | U$4.J5 v43.5,21.5 | U$4.G2 40.9,18.92 40.5,18.52 v40.5,16.5 | U$4.B11 35.5,28.5 v33.5,28.5 | U$4.H9 v41.5,26.5 | U$4.H7 v41.5,23.5 | U$4.G8 v40.5,24.5 | U$4.M8 v46.5,24.5 | U$4.H12 v41.5,29.5 | U$4.E9 v38.5,26.5 | U$4.L15 45.5,32.5 v45.5,34.5 | v40.5,34.5 40.5,32.5 U$4.G15 | v34.5,33.5 U$4.A16 | v33.5,23.5 35.5,23.5 U$4.B7 | v45.5,16.5 45.5,18.5 U$4.L2 | v51.5,22.5 49.5,22.5 U$4.R6 | v51.5,27.5 49.5,27.5 U$4.R10 | v43.5,24.5 U$4.J8 v44.5,23.5 U$4.K7 v43.5,24.5
  other vias: 3.5,3.5 3.5,52.5 61.5,52.5 61.5,3.5
  pour Route15: 0,56 85,56 85,0 0,0
N$1  (via drill 3.3)
  other vias: 26,40
N$2  (via drill 3.3)
  other vias: 3.5,45
N$3  (1 unrouted)
N$17  (via drill 0.25)
  Top 0.102: U$4.E7 v38.5,23.5
N$18  (via drill 0.25)
  Top 0.102: U$4.E8 v38.5,24.5
VCC12  (via drill 0.25)  (1 unrouted)
  Top 0.305: U$4.J9 U$4.H10 v41.5,27.5 v44.5,24.5 U$4.K8 U$4.J9 | U$4.J9 U$4.H8 U$4.G7 v40.5,23.5 U$4.K10 | U$4.K10 U$4.J9 | U$4.K10 v43.5,26.5 | U$4.J7 U$4.G9 v40.5,26.5 v43.5,23.5 U$4.J7
VCC15  (via drill 0.25)  (7 unrouted)
  Top 0.305: U$4.G13 v40.5,30.5 | U$4.K13 v44.5,30.5 | U$4.N15 47.5,32.5 v47.5,34.5 | U$4.J15 43.5,32.5 v43.5,34.5 | v37.5,34.5 37.5,32.5 U$4.D15 | v51.5,30.5 49.5,30.5 U$4.R13 | 37,46.8 v37.4,46.4 | 38.6,46.8 v38.2,46.4
VCC33  (via drill 0.25)  (20 unrouted)
  Top 0.305: U$4.N7 v47.5,23.5 | U$4.N10 v47.5,27.5 | v44.5,20.5 U$4.K4 | U$4.D10 v37.5,27.5 | U$4.D7 v37.5,23.5 | U$4.G10 40.46,27.55 | U$4.G10 U$4.F11 v39.5,28.5 U$4.G10 | U$4.E5 v38.5,21.5 | U$4.F8 v39.5,24.5 | U$4.H6 v41.5,22.5 | U$4.G4 v40.5,20.5 | U$4.L6 v45.5,22.5 | U$4.B13 35.5,30.5 v33.5,30.5 | U$4.L9 v45.5,26.5 | U$4.J10 v43.5,27.5 | v33.5,26.5 35.5,26.5 U$4.B9 | v33.5,20.5 35.5,20.5 U$4.B4 | v37.5,16.5 37.5,18.5 U$4.D2 | v43.5,16.5 43.5,18.5 U$4.J2 | v47.5,16.5 47.5,18.5 U$4.N2 | v51.5,20.5 49.5,20.5 U$4.R4 | v51.5,24.5 49.5,24.5 U$4.R8
  pour Route2 (rank 3): 0,56 85,56 85,0 0,0
VCC_1.5  (17 unrouted)
VCCINT
  pour Route2: 32,33 32,31.5 33.5,30 34.5,30 36.5,28 36.5,27.5 36.5,18.5 37,18 37.5,18 38,18.5 38,19 37.5,19.5 37.5,28 35,30.5 35,31.5 33.5,33
VCCO_1
  pour Route2: 38,24.5 38.5,24 41,26.5 41,36.5 40.65,36.85 40.38,36.85 38,34.47 38,29 39,28 39,26.17 38,25.17